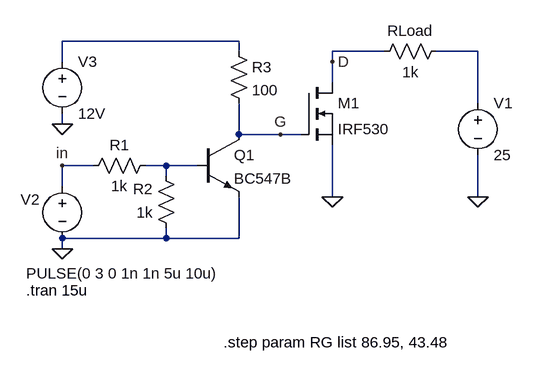
[diagram p0: schematic lab_05_LSSchalter_Pegelwandler_Loesung.asc]
lab_05_LSSchalter_Pegelwandler_Loesung.asc, the LTspice schematic file:
Version 4
SHEET 1 880 680
WIRE -80 -80 -352 -80
WIRE -80 -64 -80 -80
WIRE 144 -64 64 -64
WIRE 288 -64 224 -64
WIRE -352 -48 -352 -80
WIRE 64 -48 64 -64
WIRE 64 -16 64 -48
WIRE 288 16 288 -64
WIRE -352 48 -352 32
WIRE -80 64 -80 16
WIRE -16 64 -80 64
WIRE 16 64 -16 64
WIRE -304 112 -352 112
WIRE -192 112 -224 112
WIRE -144 112 -192 112
WIRE -192 128 -192 112
WIRE -352 144 -352 112
WIRE 64 160 64 80
WIRE 288 160 288 96
WIRE -192 224 -192 208
WIRE -192 224 -352 224
WIRE -80 224 -80 160
WIRE -80 224 -192 224
WIRE -352 240 -352 224
FLAG 64 160 0
FLAG -352 240 0
FLAG 288 160 0
FLAG -16 64 G
FLAG 64 -48 D
FLAG -352 112 in
FLAG -352 48 0
SYMBOL nmos 16 -16 R0
SYMATTR InstName M1
SYMATTR Value IRF530
SYMBOL voltage 288 0 R0
SYMATTR InstName V1
SYMATTR Value 25
SYMBOL voltage -352 128 R0
WINDOW 123 0 0 Left 0
WINDOW 39 0 0 Left 0
WINDOW 0 -64 36 Left 2
WINDOW 3 -56 150 Left 2
SYMATTR InstName V2
SYMATTR Value PULSE(0 3 0 1n 1n 5u 10u)
SYMBOL res 240 -80 R90
WINDOW 0 0 56 VBottom 2
WINDOW 3 32 56 VTop 2
SYMATTR InstName RLoad
SYMATTR Value 1k
SYMBOL npn -144 64 R0
SYMATTR InstName Q1
SYMATTR Value BC547B
SYMBOL res -208 96 R90
WINDOW 0 0 56 VBottom 2
WINDOW 3 32 56 VTop 2
SYMATTR InstName R1
SYMATTR Value 1k
SYMBOL res -176 224 R180
WINDOW 0 36 76 Left 2
WINDOW 3 36 40 Left 2
SYMATTR InstName R2
SYMATTR Value 1k
SYMBOL res -96 -80 R0
SYMATTR InstName R3
SYMATTR Value 100
SYMBOL voltage -352 -64 R0
WINDOW 123 0 0 Left 0
WINDOW 39 0 0 Left 0
SYMATTR InstName V3
SYMATTR Value 12V
TEXT -408 304 Left 2 !.tran 15u
TEXT -104 384 Left 2 !.step param RG list 86.95, 43.48

The netlist it stands for:
* lab_05_LSSchalter_Pegelwandler_Loesung.asc
M1 D G 0 0 IRF530
V1 N002 0 25
V2 in 0 PULSE(0 3 0 1n 1n 5u 10u)
RLoad N002 D 1k
Q1 G N003 0 0 BC547B
R1 N003 in 1k
R2 0 N003 1k
R3 N001 G 100
V3 N001 0 12V
.model NPN NPN
.model PNP PNP
.lib standard.bjt
.model NMOS NMOS
.model PMOS PMOS
.lib standard.mos
.tran 15u
.step param RG list 86.95, 43.48
.backanno
.end